# EAGLE design CCM_0017 (EAGLE 9.0.1)
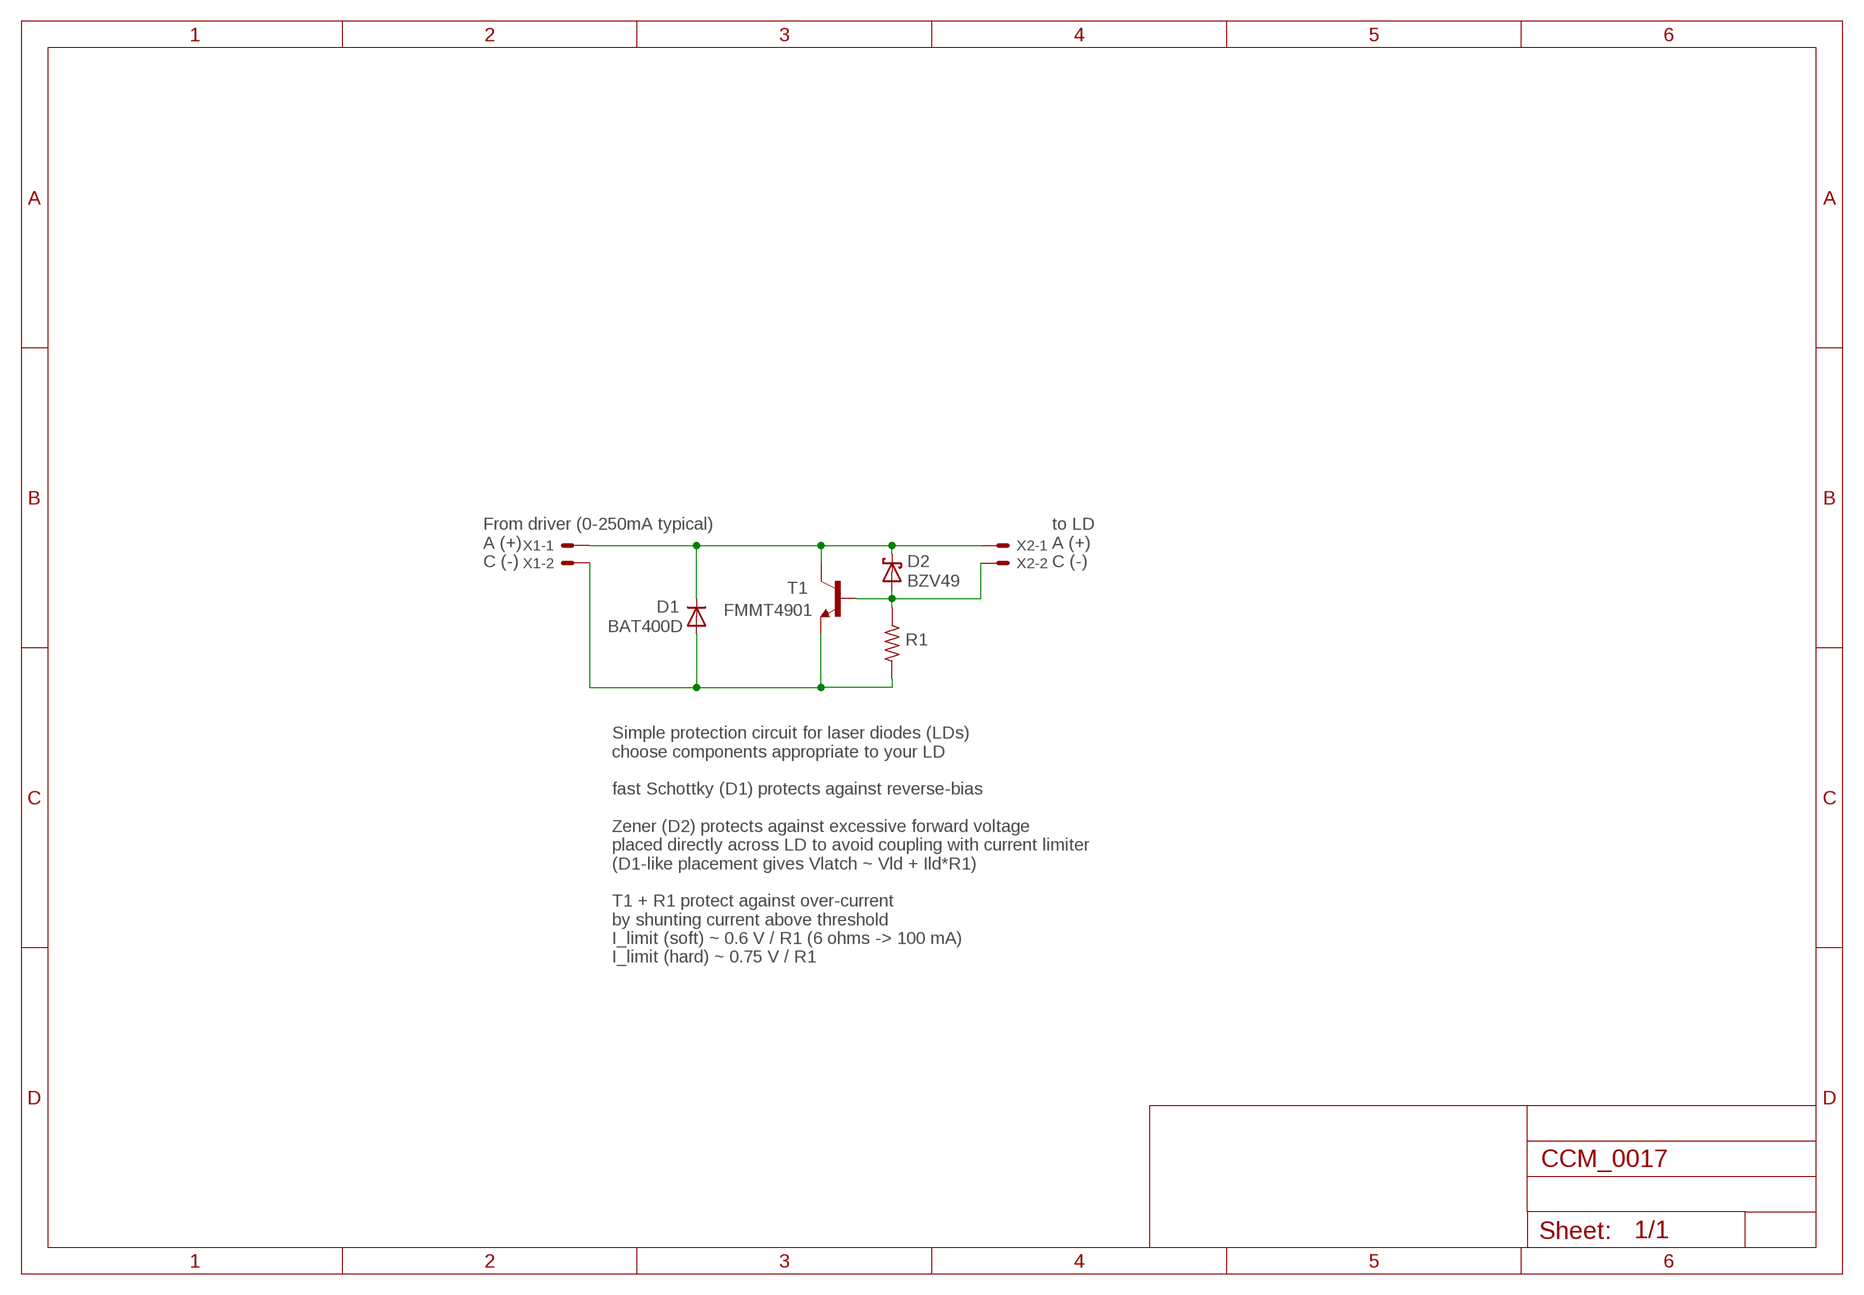
[diagram p0: schematic, sheet 1]

## Parts
D1  BAT400D  HSMS-2850  [SOT23]
D2  BZV49  [SOT89]
R1  4.3  RESISTOR1210  [1210]
T1  FMMT4901  MMBT4401LT1-NPN-SOT23-BEC  [SOT23-BEC]
X1  22-23-2021  [22-23-2021]
X2  22-23-2021  [22-23-2021]

## Nets
N$4: D2.1(A) D2.3(A) R1.1 T1.B X2.2
N$5: D1.1(A) R1.2 T1.E X1.2
N$7: D1.3(C) D2.2(C) D2.2@1(C) T1.C X1.1 X2.1

## Notes on the sheet
- From driver (0-250mA typical)
  A (+)
  C (-)
- to LD
  A (+)
  C (-)
- Simple protection circuit for laser diodes (LDs)
  choose components appropriate to your LD
  
  fast Schottky (D1) protects against reverse-bias
  
  Zener (D2) protects against excessive forward voltage
  placed directly across LD to avoid coupling with current limiter
  (D1-like placement gives Vlatch ~ Vld + Ild*R1)
  
  T1 + R1 protect against over-current
  by shunting current above threshold
  I_limit (soft) ~ 0.6 V / R1 (6 ohms -> 100 mA)
  I_limit (hard) ~ 0.75 V / R1

## Library data of the parts
D1 = avago:HSMS-2850: Surface Mount Microwave Schottky Detector Diodes Source: Data sheet <http://www.farnell.com/datasheets/461166.pdf>
D2 = noah:BZV49
R1 = noah:RESISTOR: RESISTOR, American symbol
T1 = transistor:*-NPN-: NPN Transistror BF959 corrected 2008.03.06
X1 X2 = con-molex:22-23-2021: .100" (2.54mm) Center Header - 2 Pin; MF: MOLEX; MPN: 22-23-2021; OC_FARNELL: 1462926; OC_NEWARK: 25C3832

## Net classes
1 standard: width 0.61 mm, clearance 0.254 mm

## Board
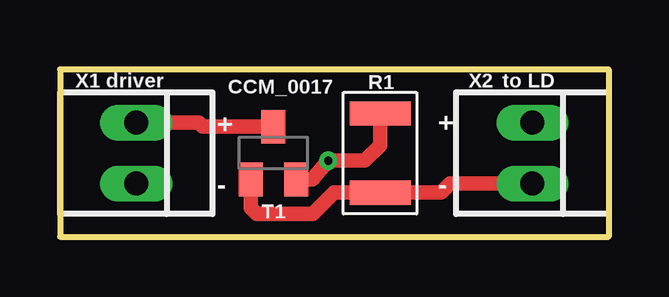
[diagram p1: board, top side]
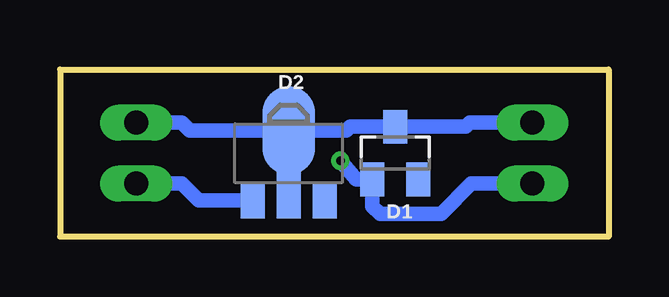
[diagram p2: board, bottom side, seen from below]

Size 22.86 x 6.99 mm. Coordinates in mm from the lower left corner, seen from the top.
Outline: 0,0 22.86,0 22.86,6.99 0,6.99 0,0
Copper layers (1*16): Top 0.035mm / dielectric 1.5mm / Bottom 0.035mm
Design rules "default *": minimum track width 10mil, minimum drill 10mil, track to track 7mil, track to pad 7mil, pad to pad 7mil, via to via 7mil, smd to smd 7mil, copper to edge 10mil, drill to drill 8mil, minimum pad ring 10mil, minimum via ring 8mil, stop-mask expansion 4mil, vias tented up to drill 0mil, thermal gap 10mil

### Footprints (pad centres in the part's own frame; a part is rotated, then mirrored left to right if it is on the bottom)
SOT23 = smd 1 x 1.4: 1 -0.95,-1.1; 2 0.95,-1.1; 3 0,1.1
SOT89 = smd 1 x 1.5: 1 -1.499,-1.981; 3 1.499,-1.981 | smd 1 x 2: 2 0,-1.727 | smd 2.2 x 3.7: 2@1 0,0.94
1210 = smd 1.016 x 2.54: 1 -1.651,0; 2 1.651,0
SOT23-BEC = smd 1 x 1.4: B -0.95,-1.1; C 0,1.1; E 0.95,-1.1
22-23-2021 = drill 1 long: 1 -1.27,0; 2 1.27,0

### Placement (x,y rotation side)
D1  8.89,3.49 0 bottom
D2  13.34,3.49 0 bottom
R1  13.34,3.49 90 top
T1  8.89,3.49 0 top
X1  3.17,3.49 270 top
X2  19.68,3.49 270 top

### Tracks (layer width: path | path; a pad name or v marks a point on that pad's centre or on a via)
N$4
  Top 0.61: X2.2 16.26,2.22 15.88,1.84 R1.1 11.43,1.84 10.54,0.95 8.19,0.95 7.94,1.2 T1.B
  Bottom 0.61: D2.1 17.07,1.51 17.78,2.22 X2.2
N$5  (via drill 0.35)
  Top 0.61: R1.2 13.34,3.81 12.7,3.17 v11.18,3.17 10.52,2.39 D1.1
  Bottom 0.61: X1.2 5.71,2.22 6.99,0.95 9.53,0.95 9.84,1.27 D1.1 10.52,2.39 v11.18,3.17
N$7
  Top 0.61: X1.1 5.78,4.76 5.95,4.59 D1.3
  Bottom 0.61: X2.1 17.78,4.76 17.45,4.43 D2.2@1 10.93,4.43 10.77,4.59 D1.3 5.95,4.59 5.78,4.76 X1.1

### Text on the board
tNames: driver | CCM_0017 | to LD | + | + | - | -